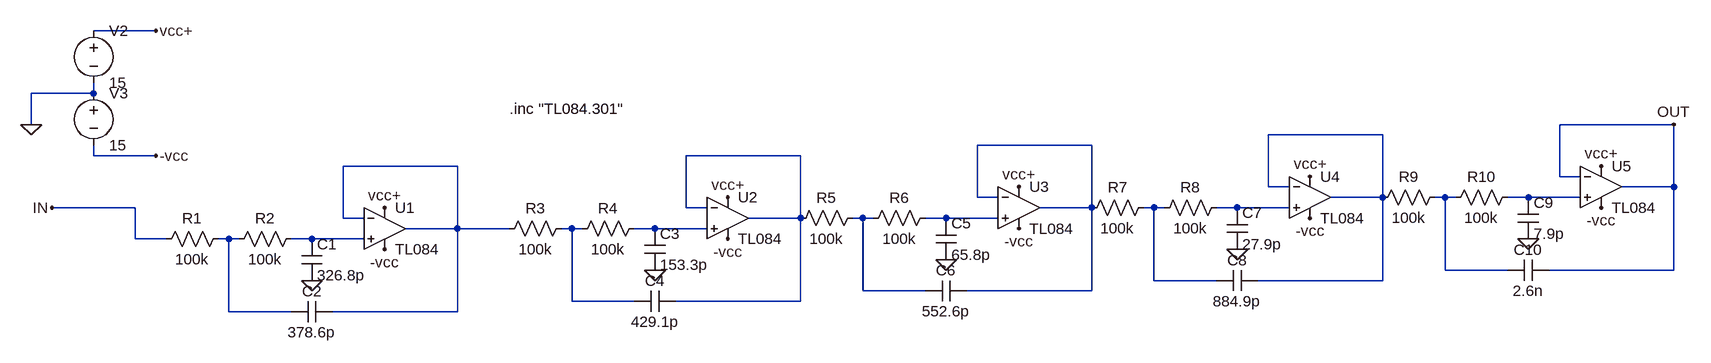
[diagram p0: schematic FAA.asc]
FAA.asc, the LTspice schematic file:
Version 4
SHEET 1 3080 680
WIRE 144 -192 48 -192
WIRE 48 -96 48 -112
WIRE 48 -96 -48 -96
WIRE -48 -48 -48 -96
WIRE 2480 -48 2304 -48
WIRE 2032 -32 1856 -32
WIRE 1584 -16 1408 -16
WIRE 48 0 48 -16
WIRE 144 0 48 0
WIRE 1136 0 960 0
WIRE 608 16 432 16
WIRE 2304 32 2304 -48
WIRE 2336 32 2304 32
WIRE 1856 48 1856 -32
WIRE 1888 48 1856 48
WIRE 2480 48 2480 -48
WIRE 2480 48 2400 48
WIRE 1408 64 1408 -16
WIRE 1440 64 1408 64
WIRE 2032 64 2032 -32
WIRE 2032 64 1952 64
WIRE 2128 64 2112 64
WIRE 2144 64 2128 64
WIRE 2256 64 2224 64
WIRE 2336 64 2256 64
WIRE 112 80 -16 80
WIRE 960 80 960 0
WIRE 992 80 960 80
WIRE 1584 80 1584 -16
WIRE 1584 80 1504 80
WIRE 1680 80 1664 80
WIRE 1696 80 1680 80
WIRE 1808 80 1776 80
WIRE 1888 80 1808 80
WIRE 432 96 432 16
WIRE 464 96 432 96
WIRE 1136 96 1136 0
WIRE 1136 96 1056 96
WIRE 1232 96 1216 96
WIRE 1248 96 1232 96
WIRE 1360 96 1328 96
WIRE 1440 96 1360 96
WIRE 608 112 608 16
WIRE 608 112 528 112
WIRE 688 112 608 112
WIRE 784 112 768 112
WIRE 800 112 784 112
WIRE 912 112 880 112
WIRE 992 112 912 112
WIRE 112 128 112 80
WIRE 160 128 112 128
WIRE 256 128 240 128
WIRE 272 128 256 128
WIRE 384 128 352 128
WIRE 464 128 384 128
WIRE 2128 176 2128 64
WIRE 2224 176 2128 176
WIRE 2480 176 2480 48
WIRE 2480 176 2288 176
WIRE 1680 192 1680 80
WIRE 1776 192 1680 192
WIRE 2032 192 2032 64
WIRE 2032 192 1840 192
WIRE 1232 208 1232 96
WIRE 1328 208 1232 208
WIRE 1584 208 1584 80
WIRE 1584 208 1392 208
WIRE 784 224 784 112
WIRE 880 224 784 224
WIRE 1136 224 1136 96
WIRE 1136 224 944 224
WIRE 256 240 256 128
WIRE 352 240 256 240
WIRE 608 240 608 112
WIRE 608 240 416 240
FLAG 144 -192 vcc+
FLAG 496 80 vcc+
FLAG 144 0 -vcc
FLAG 496 144 -vcc
FLAG -48 -48 0
FLAG -16 80 IN
FLAG 384 192 0
FLAG 1024 64 vcc+
FLAG 1024 128 -vcc
FLAG 912 176 0
FLAG 1472 48 vcc+
FLAG 1472 112 -vcc
FLAG 1360 160 0
FLAG 1920 32 vcc+
FLAG 1920 96 -vcc
FLAG 1808 144 0
FLAG 2368 16 vcc+
FLAG 2368 80 -vcc
FLAG 2256 128 0
FLAG 2480 -48 OUT
SYMBOL Opamps\\opamp2 496 48 R0
SYMATTR InstName U1
SYMATTR Value TL084
SYMBOL voltage 48 -208 R0
SYMATTR InstName V2
SYMATTR Value 15
SYMBOL voltage 48 -112 R0
SYMATTR InstName V3
SYMATTR Value 15
SYMBOL res 256 112 R90
WINDOW 0 0 56 VBottom 2
WINDOW 3 32 56 VTop 2
SYMATTR InstName R1
SYMATTR Value 100k
SYMBOL res 368 112 R90
WINDOW 0 0 56 VBottom 2
WINDOW 3 32 56 VTop 2
SYMATTR InstName R2
SYMATTR Value 100k
SYMBOL cap 368 128 R0
SYMATTR InstName C1
SYMATTR Value 326.8p
SYMBOL cap 416 224 R90
WINDOW 0 0 32 VBottom 2
WINDOW 3 32 32 VTop 2
SYMATTR InstName C2
SYMATTR Value 378.6p
SYMBOL Opamps\\opamp2 1024 32 R0
SYMATTR InstName U2
SYMATTR Value TL084
SYMBOL res 784 96 R90
WINDOW 0 0 56 VBottom 2
WINDOW 3 32 56 VTop 2
SYMATTR InstName R3
SYMATTR Value 100k
SYMBOL res 896 96 R90
WINDOW 0 0 56 VBottom 2
WINDOW 3 32 56 VTop 2
SYMATTR InstName R4
SYMATTR Value 100k
SYMBOL cap 896 112 R0
SYMATTR InstName C3
SYMATTR Value 153.3p
SYMBOL cap 944 208 R90
WINDOW 0 0 32 VBottom 2
WINDOW 3 32 32 VTop 2
SYMATTR InstName C4
SYMATTR Value 429.1p
SYMBOL Opamps\\opamp2 1472 16 R0
SYMATTR InstName U3
SYMATTR Value TL084
SYMBOL res 1232 80 R90
WINDOW 0 0 56 VBottom 2
WINDOW 3 32 56 VTop 2
SYMATTR InstName R5
SYMATTR Value 100k
SYMBOL res 1344 80 R90
WINDOW 0 0 56 VBottom 2
WINDOW 3 32 56 VTop 2
SYMATTR InstName R6
SYMATTR Value 100k
SYMBOL cap 1344 96 R0
SYMATTR InstName C5
SYMATTR Value 65.8p
SYMBOL cap 1392 192 R90
WINDOW 0 0 32 VBottom 2
WINDOW 3 32 32 VTop 2
SYMATTR InstName C6
SYMATTR Value 552.6p
SYMBOL Opamps\\opamp2 1920 0 R0
SYMATTR InstName U4
SYMATTR Value TL084
SYMBOL res 1680 64 R90
WINDOW 0 0 56 VBottom 2
WINDOW 3 32 56 VTop 2
SYMATTR InstName R7
SYMATTR Value 100k
SYMBOL res 1792 64 R90
WINDOW 0 0 56 VBottom 2
WINDOW 3 32 56 VTop 2
SYMATTR InstName R8
SYMATTR Value 100k
SYMBOL cap 1792 80 R0
SYMATTR InstName C7
SYMATTR Value 27.9p
SYMBOL cap 1840 176 R90
WINDOW 0 0 32 VBottom 2
WINDOW 3 32 32 VTop 2
SYMATTR InstName C8
SYMATTR Value 884.9p
SYMBOL Opamps\\opamp2 2368 -16 R0
SYMATTR InstName U5
SYMATTR Value TL084
SYMBOL res 2128 48 R90
WINDOW 0 0 56 VBottom 2
WINDOW 3 32 56 VTop 2
SYMATTR InstName R9
SYMATTR Value 100k
SYMBOL res 2240 48 R90
WINDOW 0 0 56 VBottom 2
WINDOW 3 32 56 VTop 2
SYMATTR InstName R10
SYMATTR Value 100k
SYMBOL cap 2240 64 R0
SYMATTR InstName C9
SYMATTR Value 7.9p
SYMBOL cap 2288 160 R90
WINDOW 0 0 32 VBottom 2
WINDOW 3 32 32 VTop 2
SYMATTR InstName C10
SYMATTR Value 2.6n
TEXT 688 -72 Left 2 !.inc "TL084.301"

The netlist it stands for:
* FAA.asc
XU1 N014 N004 vcc+ -vcc N004 TL084  ; pins In+ In- V+ V- OUT
V2 vcc+ 0 15
V3 0 -vcc 15
R1 N013 IN 100k
R2 N014 N013 100k
C1 N014 0 326.8p
C2 N004 N013 378.6p
XU2 N012 N003 vcc+ -vcc N003 TL084  ; pins In+ In- V+ V- OUT
R3 N011 N004 100k
R4 N012 N011 100k
C3 N012 0 153.3p
C4 N003 N011 429.1p
XU3 N010 N002 vcc+ -vcc N002 TL084  ; pins In+ In- V+ V- OUT
R5 N009 N003 100k
R6 N010 N009 100k
C5 N010 0 65.8p
C6 N002 N009 552.6p
XU4 N008 N001 vcc+ -vcc N001 TL084  ; pins In+ In- V+ V- OUT
R7 N007 N002 100k
R8 N008 N007 100k
C7 N008 0 27.9p
C8 N001 N007 884.9p
XU5 N006 OUT vcc+ -vcc OUT TL084  ; pins In+ In- V+ V- OUT
R9 N005 N001 100k
R10 N006 N005 100k
C9 N006 0 7.9p
C10 OUT N005 2.6n
.inc "TL084.301"
.backanno
.end